# EAGLE design GabozePocaioRound2 (EAGLE 9.4.0)
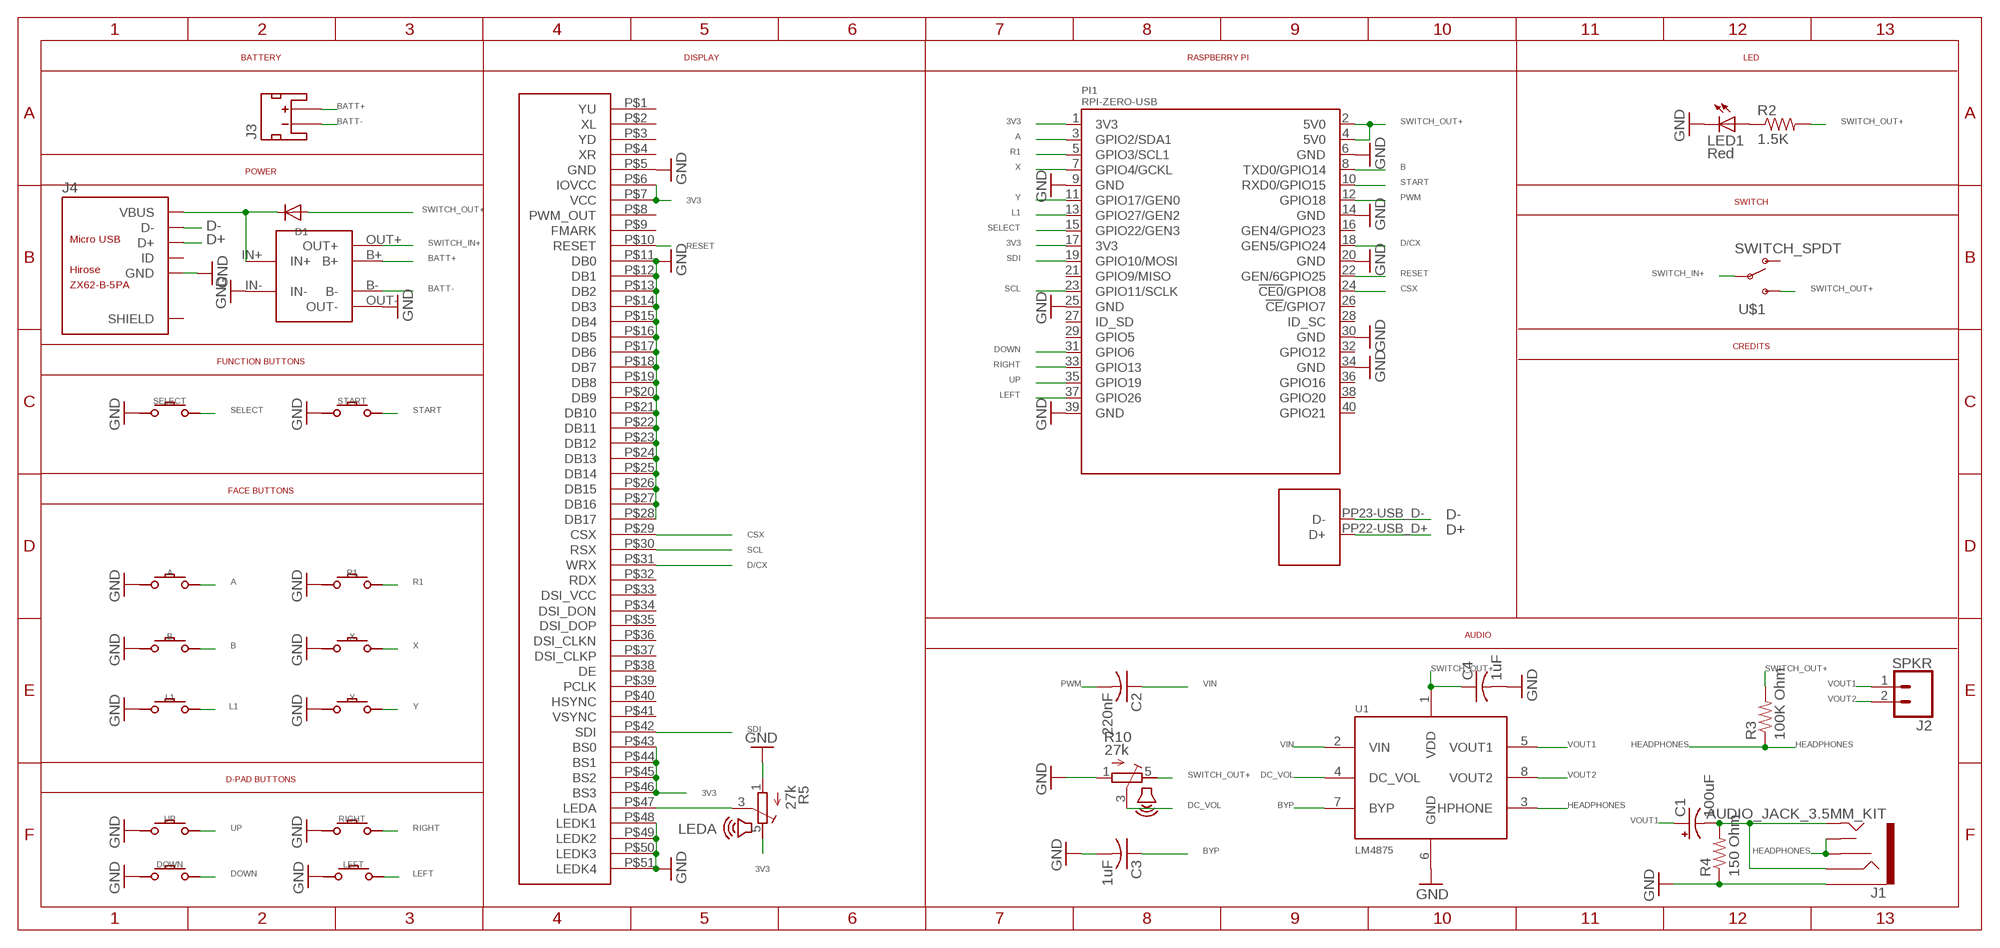
[diagram p0: schematic, sheet 1]

## Parts
A  CONDUCTIVE_BUTTONCONDUCTIVE_BUTTON_THICK  [CONDUCTIVE_BUTTON_THICK]
B  CONDUCTIVE_BUTTONCONDUCTIVE_BUTTON_THICK  [CONDUCTIVE_BUTTON_THICK]
C1  100uF  10UF-POLAR-EIA3216-16V-10%(TANT)  [EIA3216]
C2  220nF  C-USC0805  [C0805]
C3  1uF  C-USC0805  [C0805]
C4  1uF  C-USC0805  [C0805]
D1  DIODE_SOD-123FL  [SOD-123FL]
DOWN  CONDUCTIVE_BUTTONCONDUCTIVE_BUTTON_DIRECTIONAL_THICK  [CONDUCTIVE_BUTTON_DIRECTIONAL_THICK]
J1  AUDIO_JACK_3.5MM_KIT  [AUDIO-JACK-KIT]
J2  SPKR  CONN_02  [1X02]
J3  Batt Conn  JST_2MM_MALE  [JST-2-SMD]
J4  ZX62-B-5PA  MICRO-USB-SMD(ZX62-B-5PA)  [MICRO-USB5+6P-SMD-0.65-AB]
L1  CONDUCTIVE_BUTTON_DRILLCONDUCTIVE_BUTTON_DRILL_THICK  [CONDUCTIVE_BUTTON_THICK_DRILL]
LED1  Red  LED3MM  [LED3MM]
LEFT  CONDUCTIVE_BUTTONCONDUCTIVE_BUTTON_DIRECTIONAL_THICK  [CONDUCTIVE_BUTTON_DIRECTIONAL_THICK]
PI1  RPI-ZERO-USB  [RPI-ZERO-TH-USB-POGO]
POWER1  TP4056  [TP4056]
R1  CONDUCTIVE_BUTTON_DRILLCONDUCTIVE_BUTTON_DRILL_THICK  [CONDUCTIVE_BUTTON_THICK_DRILL]
R2  1.5K  R-US_R0805  [R0805]
R3  100K Ohm  R-US_R0805  [R0805]
R4  150 Ohm  R-US_R0805  [R0805]
R5  27k  VOLUME  [VOLUME]
R10  27k  VOLUME  [VOLUME]
RIGHT  CONDUCTIVE_BUTTONCONDUCTIVE_BUTTON_DIRECTIONAL_THICK  [CONDUCTIVE_BUTTON_DIRECTIONAL_THICK]
SELECT  CONDUCTIVE_BUTTON_STARTSELECTCONDUCTIVE_BUTTON_THICK_STARTSELECT  [CONDUCTIVE_BUTTON_THICK_STARTSELECT]
START  CONDUCTIVE_BUTTON_STARTSELECTCONDUCTIVE_BUTTON_THICK_STARTSELECT  [CONDUCTIVE_BUTTON_THICK_STARTSELECT]
U1  LM4875  [SOIC8]
U$1  SWITCH_SPDT  [KPS-1290]
U$2  TFT-DISPLAY-2.6-51PIN  [TFT-DISPLAY-2.6-51PIN]
UP  CONDUCTIVE_BUTTONCONDUCTIVE_BUTTON_DIRECTIONAL_THICK  [CONDUCTIVE_BUTTON_DIRECTIONAL_THICK]
X  CONDUCTIVE_BUTTON_DRILLCONDUCTIVE_BUTTON_DRILL_THICK  [CONDUCTIVE_BUTTON_THICK_DRILL]
Y  CONDUCTIVE_BUTTON_DRILLCONDUCTIVE_BUTTON_DRILL_THICK  [CONDUCTIVE_BUTTON_THICK_DRILL]

## Nets
3V3: PI1.1(3V3) PI1.17(3V3) R5.5(E) U$2.P$6(IOVCC) U$2.P$7(VCC) U$2.P$43(BS0) U$2.P$44(BS1) U$2.P$45(BS2) U$2.P$46(BS3)
A: A.P$ACTIVE PI1.3(GPIO2/SDA1)
B: B.P$ACTIVE PI1.8(TXD0/GPIO14)
BATT+: J3.2(+) POWER1.B+
BATT-: J3.1(-) POWER1.B-
BYP: C3.1 U1.7(BYP)
CSX: PI1.24(!CE0!/GPIO8) U$2.P$29(CSX)
D+: J4.3(D+) PI1.PP22-USB_D+(D+)
D-: J4.2(D-) PI1.PP23-USB_D-(D-)
D/CX: PI1.18(GEN5/GPIO24) U$2.P$31(WRX)
DC_VOL: R10.3(S) U1.4(DC_VOL)
DOWN: DOWN.P$ACTIVE PI1.31(GPIO6)
GND: A.P$GND B.P$GND C3.2 C4.2 DOWN.P$GND J1.SLEEVE J4.5(GND) L1.P$GND LED1.K(C) LEFT.P$GND PI1.6(GND) PI1.9(GND) PI1.14(GND) PI1.20(GND) PI1.25(GND) PI1.30(GND) PI1.34(GND) PI1.39(GND) POWER1.IN- POWER1.OUT- R1.P$GND R4.1 R5.1(A) R10.1(A) RIGHT.P$GND SELECT.P$GND SELECT.P$GND1(P$GND) SELECT.P$GND2(P$GND) SELECT.P$GND3(P$GND) START.P$GND START.P$GND1(P$GND) START.P$GND2(P$GND) START.P$GND3(P$GND) U1.6(GND) U$2.P$5(GND) U$2.P$11(DB0) U$2.P$12(DB1) U$2.P$13(DB2) U$2.P$14(DB3) U$2.P$15(DB4) U$2.P$16(DB5) U$2.P$17(DB6) U$2.P$18(DB7) U$2.P$19(DB8) U$2.P$20(DB9) U$2.P$21(DB10) U$2.P$22(DB11) U$2.P$23(DB12) U$2.P$24(DB13) U$2.P$25(DB14) U$2.P$26(DB15) U$2.P$27(DB16) U$2.P$28(DB17) U$2.P$48(LEDK1) U$2.P$49(LEDK2) U$2.P$50(LEDK3) U$2.P$51(LEDK4) UP.P$GND X.P$GND Y.P$GND
HEADPHONES: J1.RSH J1.TSH R3.1 U1.3(HPHONE)
L1: L1.P$ACTIVE PI1.13(GPIO27/GEN2)
LED: LED1.A R2.1
LEDA: R5.3(S) U$2.P$47(LEDA)
LEFT: LEFT.P$ACTIVE PI1.37(GPIO26)
PWM: C2.2 PI1.12(GPIO18)
R1: PI1.5(GPIO3/SCL1) R1.P$ACTIVE
RESET: PI1.22(GEN/6GPIO25) U$2.P$10(RESET)
RIGHT: PI1.33(GPIO13) RIGHT.P$ACTIVE
SCL: PI1.23(GPIO11/SCLK) U$2.P$30(RSX)
SDI: PI1.19(GPIO10/MOSI) U$2.P$42(SDI)
SELECT: PI1.15(GPIO22/GEN3) SELECT.P$ACTIVE SELECT.P$ACTIVE1(P$ACTIVE) SELECT.P$ACTIVE2(P$ACTIVE) SELECT.P$ACTIVE3(P$ACTIVE)
START: PI1.10(RXD0/GPIO15) START.P$ACTIVE START.P$ACTIVE1(P$ACTIVE) START.P$ACTIVE2(P$ACTIVE) START.P$ACTIVE3(P$ACTIVE)
SWITCH_IN+: POWER1.OUT+ U$1.P
SWITCH_OUT+: C4.1 D1.A PI1.2(5V0) PI1.4(5V0) R2.2 R3.2 R10.5(E) U1.1(VDD) U$1.S
UP: PI1.35(GPIO19) UP.P$ACTIVE
VIN: C2.1 U1.2(VIN)
VIN1: C1.- J1.RING J1.TIP R4.2
VOUT1: C1.+ J2.1 U1.5(VOUT1)
VOUT2: J2.2 U1.8(VOUT2)
VUSB: D1.C J4.1(VBUS) POWER1.IN+
X: PI1.7(GPIO4/GCKL) X.P$ACTIVE
Y: PI1.11(GPIO17/GEN0) Y.P$ACTIVE
Unconnected: J3.NC1(PAD1) J3.NC2(PAD2) J4.4(ID) J4.P1(SHIELD) J4.P2(SHIELD) J4.P3(SHIELD) J4.P4(SHIELD) J4.P5(SHIELD) J4.P6(SHIELD) PI1.16(GEN4/GPIO23) PI1.21(GPIO9/MISO) PI1.26(!CE!/GPIO7) PI1.27(ID_SD) PI1.28(ID_SC) PI1.29(GPIO5) PI1.32(GPIO12) PI1.36(GPIO16) PI1.38(GPIO20) PI1.40(GPIO21) U$1.O U$2.P$1(YU) U$2.P$2(XL) U$2.P$3(YD) U$2.P$4(XR) U$2.P$8(PWM_OUT) U$2.P$9(FMARK) U$2.P$32(RDX) U$2.P$33(DSI_VCC) U$2.P$34(DSI_DON) U$2.P$35(DSI_DOP) U$2.P$36(DSI_CLKN) U$2.P$37(DSI_CLKP) U$2.P$38(DE) U$2.P$39(PCLK) U$2.P$40(HSYNC) U$2.P$41(VSYNC)

## Notes on the sheet
- BATTERY | DISPLAY | RASPBERRY PI | LED
- POWER
- SWITCH
- CREDITS
- FUNCTION BUTTONS
- FACE BUTTONS
- AUDIO
- D-PAD BUTTONS

## Library data of the parts
A B DOWN LEFT RIGHT UP = 32teeth - Conductive Buttons:CONDUCTIVE_BUTTON
C1 = SparkFun-Capacitors:10UF-POLAR: 10.0µF polarized capacitors A capacitor is a passive two-terminal electrical component used to store electrical energy temporarily in an electric field.; PROD_ID: CAP-00811; VALUE: 10uF
C2-C4 = adafruit:C-US: CAPACITOR, American symbol
D1 = adafruit:DIODE: Diode SMADIODE - SMA Surface Mount Package 20V 1A Schottky Diode Digikey: 641-1014-6-ND DO-1N4148 - Through Hole Small Current Diode SOD-123 20V 1 A (.5mV Vf) Schottky Diode - Digikey: MBRX120TPMSCT-ND SOD-323 10V 570mA (.38mV Vf, 3ns) Schottky Diode - Digikey: ZLLS410CT-ND SOD-523 30V 30mA Schottky Diode (RB751S-40TE61) - Digikey: RB751S-40TE61CT-ND SOT23-R/W - SOT23 Package (R = Solder Paste/Reflow Ovens, W = Hand-Soldering) BAT54Film 40V 300mA - Digikey: 497-7162-1-ND
J1 = SparkFun-Connectors:AUDIO_JACK_3.5MM: Audio Jack 3.5mm variants of PTH and SMT stereo audio jack with bypass switches. SparkFun Products: SparkFun SparkPunk Sound Kit <[https://www.sparkfun.com/products/11177]> - PTH MP3 Trigger <https://www.sparkfun.com/products/13720> -3.5mm SMD SparkFun PicoBoard <https://www.sparkfun.com/products/11888>- 2.5mm SMD; PROD_ID: CONN-08774; SF_ID: PRT-08032
J2 = SparkFun-Connectors:CONN_02: Multi connection point. Often used as Generic Header-pin footprint for 0.1 inch spaced/style header connections On any of the 0.1 inch spaced packages, you can populate with these: Break Away Headers - Straight <https://www.sparkfun.com/products/116> (PRT-00116) Break Away Male Headers - Right Angle <https://www.sparkfun.com/products/553> (PRT-00553) Female Headers <https://www.sparkfun.com/products/115> (PRT-00115) Break Away Headers - Machine Pin <https://www.sparkfun.com/products/117> (PRT-00117) Break Away Female Headers - Swiss Machine Pin <https://www.sparkfun.com/products/743> (PRT-00743) For SCREWTERMINALS and SPRING TERMINALS visit here: Screw Terimnals on SparkFun.com <https://www.sparkfun.com/search/results?term=Screw+Terminals> (5mm/3.5mm/2.54mm spacing) This device is also useful as a general connection point to wire up your design to another part of your project. Our various solder wires solder well into these plated through hole pads. Hook-Up Wire - Assortment (Stranded, 22 AWG) <https://www.sparkfun.com/products/11375> (PRT-11375) Hook-Up Wire - Assortment (Solid Core, 22 AWG) <https://www.sparkfun.com/products/11367> (PRT-11367) View the entire wire category on our website here <https://www.sparkfun.com/categories/141> Special notes: Molex polarized connector foot print use with: PRT-08233 with associated crimp pins and housings. 2.54_SCREWTERM for use with PRT-10571. 3.5mm Screw Terminal footprints for PRT-08084 5mm Screw Terminal footprints for use with PRT-08432
J3 = SparkFun-Connectors:JST_2MM_MALE: Mates to single-cell LiPo batteries. CONN-11443 Now with smashable polarity marks!; BTM_NEG: -; BTM_POS: +; PROD_ID: CONN-11443; TOP_NEG: -; TOP_POS: +
J4 = Seeed-Connector:MICRO-USB-SMD(ZX62-B-5PA): 320010005; MPN: ZX62-B-5PA
L1 R1 X Y = 32teeth - Conductive Buttons:CONDUCTIVE_BUTTON_DRILL
LED1 = adafruit:LED: LED OSRAM: - CHIPLED LG R971, LG N971, LY N971, LG Q971, LY Q971, LO R971, LY R971 LH N974, LH R974 LS Q976, LO Q976, LY Q976 LO Q996 - Hyper CHIPLED LW Q18S LB Q993, LB Q99A, LB R99A - SideLED LS A670, LO A670, LY A670, LG A670, LP A670 LB A673, LV A673, LT A673, LW A673 LH A674 LY A675 LS A676, LA A676, LO A676, LY A676, LW A676 LS A679, LY A679, LG A679 - Hyper Micro SIDELED® LS Y876, LA Y876, LO Y876, LY Y876 LT Y87S - SmartLED LW L88C, LW L88S LB L89C, LB L89S, LG L890 LS L89K, LO L89K, LY L89K LS L896, LA L896, LO L896, LY L896 - TOPLED LS T670, LO T670, LY T670, LG T670, LP T670 LSG T670, LSP T670, LSY T670, LOP T670, LYG T670 LG T671, LOG T671, LSG T671 LB T673, LV T673, LT T673, LW T673 LH T674 LS T676, LA T676, LO T676, LY T676, LB T676, LH T676, LSB T676, LW T676 LB T67C, LV T67C, LT T67C, LS T67K, LO T67K, LY T67K, LW E67C LS E67B, LA E67B, LO E67B, LY E67B, LB E67C, LV E67C, LT E67C LW T67C LS T679, LY T679, LG T679 LS T770, LO T770, LY T770, LG T770, LP T770 LB T773, LV T773, LT T773, LW T773 LH T774 LS E675, LA E675, LY E675, LS T675 LS T776, LA T776, LO T776, LY T776, LB T776 LHGB T686 LT T68C, LB T68C - Hyper Mini TOPLED® LB M676 - Mini TOPLED Santana® LG M470 LS M47K, LO M47K, LY M47K Source: http://www.osram.convergy.de/
PI1 = 32teeth - Gaboze-Pi:RPI-ZERO-USB
POWER1 = 32teeth - TP4056 Module:TP4056
R2-R4 = adafruit:R-US_: RESISTOR, American symbol
R5 R10 = GBA:VOLUME
SELECT START = 32teeth - Conductive Buttons:CONDUCTIVE_BUTTON_STARTSELECT
U1 = texas:LM4875
U$1 = SparkFun-Retired:SWITCH_SPDT: SWCH-10651 Side-actuated SPDT slide switch, as used on the Arduino Pro; PROD_ID: SWCH-10651
U$2 = 32teeth - 2.6" TFT 51P:TFT-DISPLAY-2.6-51PIN: ILI9342 51P 2.6" TFT LCD

## Board
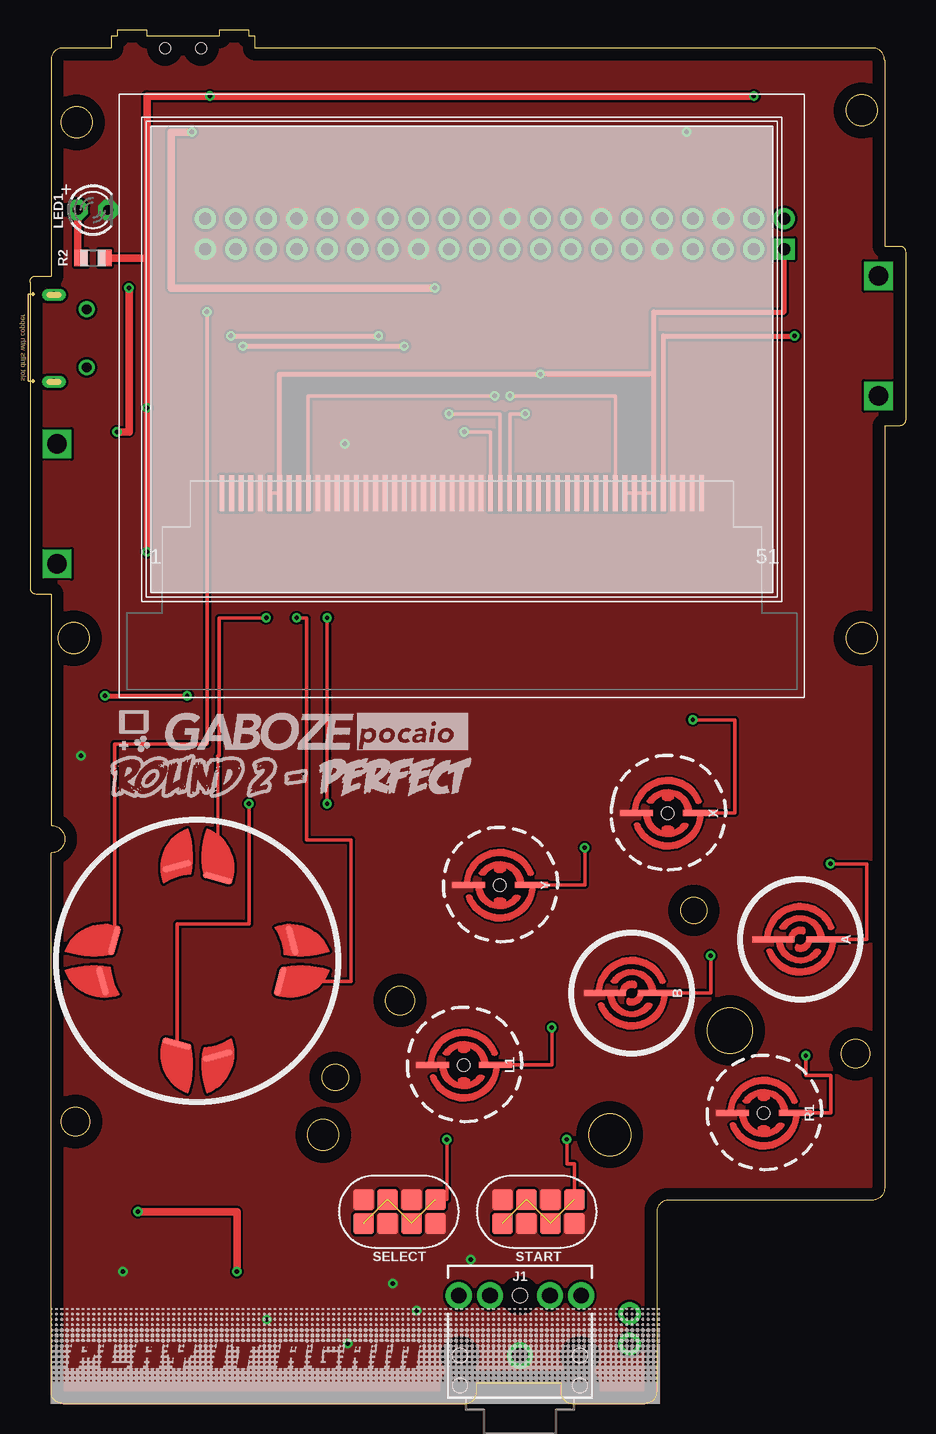
[diagram p1: board, top side]
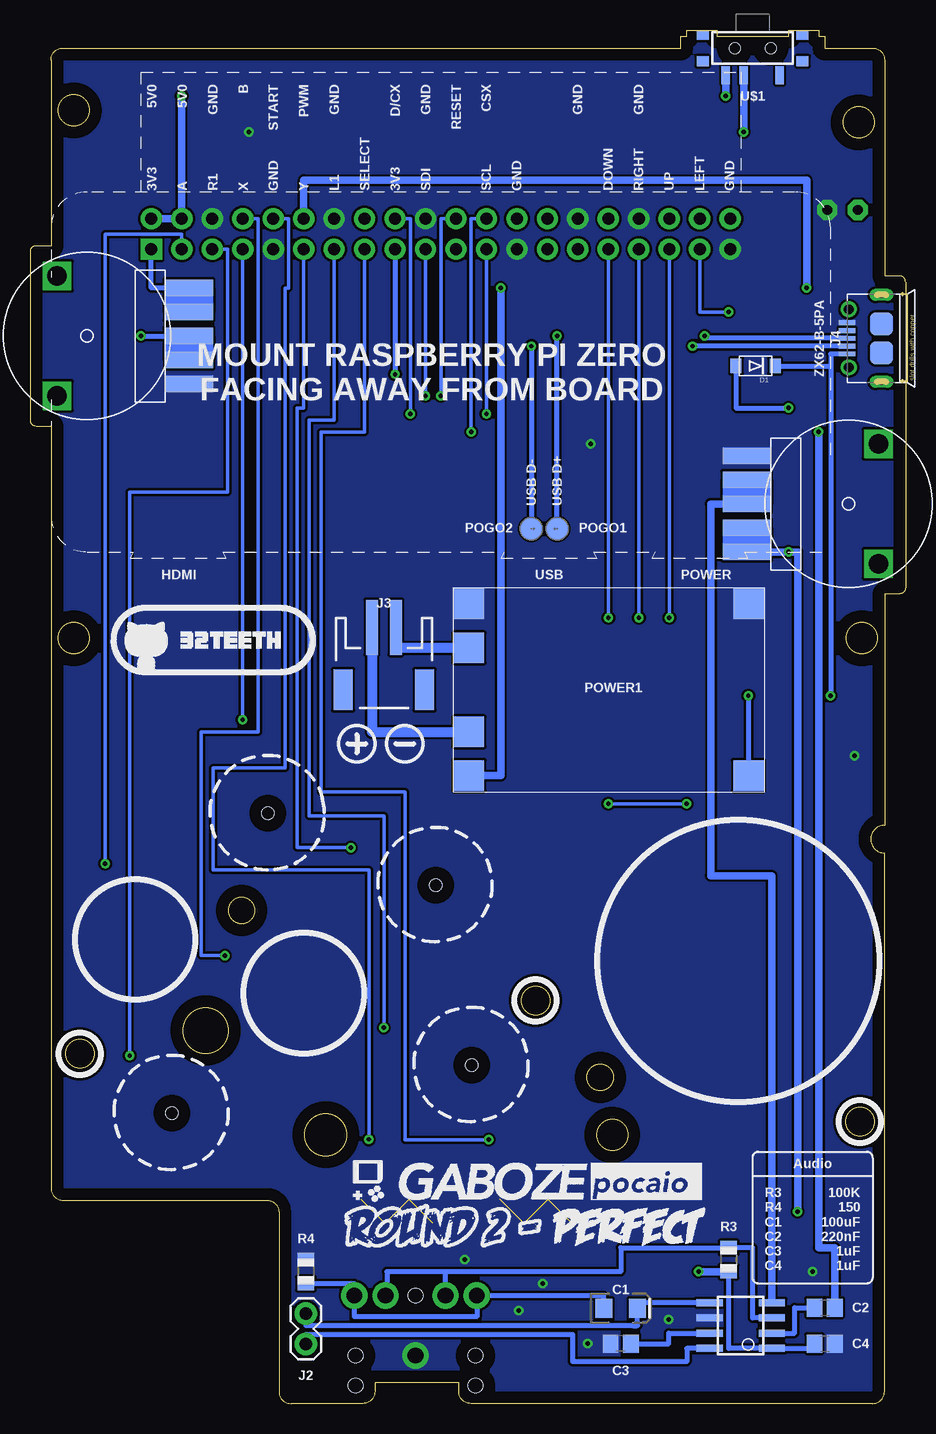
[diagram p2: board, bottom side, seen from below]

Size 73 x 114.5 mm. Coordinates in mm from the lower left corner, seen from the top.
Outline: 71.25,112 71.25,96.5 72.5,96.5 arc-90 73,96 73,82 arc-90 72.5,81.5 71.25,81.5 71.25,17.95 arc-90 70.25,16.95 53.25,16.95 arc90 52.25,15.95 52.25,1 arc-90 51.25,0 45.25,0 arc-90 44.25,1 44.25,1.75 37.25,1.75 37.25,1 arc-90 36.25,0 2.75,0 arc-90 1.75,1 1.75,45.9 arc180 1.75,48.2 1.75,67.5 0.5,67.5 arc-90 0,68 0,93.5 arc-90 0.5,94 1.75,94 1.75,112 arc-90 2.75,113 6.75,113 6.75,114 7.25,114 7.25,114.5 9.75,114.5 9.75,114 15.75,114 15.75,114.5 18.25,114.5 18.25,114 18.75,114 18.75,113 70.25,113 arc-90 71.25,112
Outline: circle at 3.8,23.5 radius 1.2
Outline: circle at 68.85,29.15 radius 1.2
Outline: circle at 58.35,31.1 radius 1.9
Outline: circle at 48.35,22.4 radius 1.75
Outline: circle at 30.85,33.6 radius 1.2
Outline: circle at 25.45,27.2 radius 1.1
Outline: circle at 24.45,22.4 radius 1.3
Outline: circle at 55.35,41.1 radius 1.1
Outline: circle at 69.35,107.8 radius 1.3
Outline: circle at 3.9,106.8 radius 1.3
Outline: circle at 69.35,63.8 radius 1.3
Outline: circle at 3.65,63.8 radius 1.3
Copper layers (1*16): Top 0.035mm / dielectric 1.5mm / Bottom 0.035mm
Design rules "default *": minimum track width 10mil, minimum drill 24mil, track to track 8mil, track to pad 8mil, pad to pad 8mil, via to via 8mil, smd to smd 8mil, copper to edge 40mil, drill to drill 8mil, minimum pad ring 10mil, minimum via ring 8mil, stop-mask expansion 5mil, vias tented up to drill 10mil, thermal gap 10mil

### Footprints (pad centres in the part's own frame; a part is rotated, then mirrored left to right if it is on the bottom)
CONDUCTIVE_BUTTON_THICK = smd 0.5 x 3.5: P$ACTIVE 0,-2.25; P$GND 0,2.25
EIA3216 = smd 1.4 x 1.6: + 1.4,0; - -1.4,0
C0805 = smd 1.3 x 1.5: 1 -0.85,0; 2 0.85,0
SOD-123FL = smd 0.91 x 1.22: A 1.637,0; C -1.637,0
CONDUCTIVE_BUTTON_DIRECTIONAL_THICK = smd 2.5 x 0.5 rotated 75: P$ACTIVE 1.1,1.7 | smd 2.5 x 0.5 rotated 285: P$GND 0.1,-1.7
AUDIO-JACK-KIT = drill 1.3 pad 2.184: RING 5,5.1; RSH 5,2.5; SLEEVE 0,0; TIP 5,-5.1; TSH 5,-2.5 | hole 1.2: 0,5; -2.5,5; -2.5,-5; 0,-5; 5,0
1X02 = drill 1.016 pad 1.88: 1 0,0; 2 2.54,0
JST-2-SMD = smd 1 x 4.6: 1 -1,-3.7; 2 1,-3.7 | smd 1.6 x 3.4: NC1 -3.4,1.5; NC2 3.4,1.5
MICRO-USB5+6P-SMD-0.65-AB = smd 0.4 x 1.35: 1 -1.3,2.875; 2 -0.65,2.875; 3 0,2.875; 4 0.65,2.875; 5 1.3,2.875 | smd 1.9 x 1.9: P1 -1.2,0; P2 1.2,0 | drill 0.508 pad 1.016 long: P3 -3.625,0; P4 3.625,0 | drill 0.8: P5 -2.425,2.73; P6 2.425,2.73
CONDUCTIVE_BUTTON_THICK_DRILL = smd 0.5 x 2.75: P$ACTIVE 0,-2.625; P$GND 0,2.625 | hole 1: 0,0
LED3MM = drill 0.813 pad 1.676 octagon: A -1.27,0; K 1.27,0
RPI-ZERO-TH-USB-POGO = drill 1 pad 1.778 square: 1 8.37,25.23 | drill 1 pad 1.778: 2 8.37,27.77; 3 10.91,25.23; 4 10.91,27.77; 5 13.45,25.23; 6 13.45,27.77; 7 15.99,25.23; 8 15.99,27.77; 9 18.53,25.23; 10 18.53,27.77; 11 21.07,25.23; 12 21.07,27.77; 13 23.61,25.23; 14 23.61,27.77; 15 26.15,25.23; 16 26.15,27.77; 17 28.69,25.23; 18 28.69,27.77; 19 31.23,25.23; 20 31.23,27.77; 21 33.77,25.23; 22 33.77,27.77; 23 36.31,25.23; 24 36.31,27.77; 25 38.85,25.23; 26 38.85,27.77; 27 41.39,25.23; 28 41.39,27.77; 29 43.93,25.23; 30 43.93,27.77; 31 46.47,25.23; 32 46.47,27.77; 33 49.01,25.23; 34 49.01,27.77; 35 51.55,25.23; 36 51.55,27.77; 37 54.09,25.23; 38 54.09,27.77; 39 56.63,25.23; 40 56.63,27.77 | smd 1.829 x 1.829: PP22-USB_D+ 42.2,1.9; PP23-USB_D- 40.05,1.9
TP4056 = smd 2.54 x 2.54: B+ 12,1.35; B- 5,1.35; IN+ 15.65,24.65; IN- 1.35,24.65; OUT+ 15.65,1.35; OUT- 1.35,1.35
R0805 = smd 1.1 x 1.4: 1 -1,0; 2 1,0
VOLUME = smd 1.4 x 4: 1 -4,-2; 2 -2,-2; 3 0,-2; 4 2,-2; 5 4,-2 | drill 1.6 square: P$6 -5,9; P$7 5,9
CONDUCTIVE_BUTTON_THICK_STARTSELECT = smd 1.75 x 1.75: P$ACTIVE 3,1; P$ACTIVE1 -1,1; P$ACTIVE2 -3,-1; P$ACTIVE3 1,-1; P$GND 1,1; P$GND1 -3,1; P$GND2 -1,-1; P$GND3 3,-1
SOIC8 = smd 0.6 x 2.2: 1 -1.905,-2.6; 2 -0.635,-2.6; 3 0.635,-2.6; 4 1.905,-2.6; 5 1.905,2.6; 6 0.635,2.6; 7 -0.635,2.6; 8 -1.905,2.6
KPS-1290 = smd 0.7 x 1.5: O -2.25,2.25; P 0.75,2.25; S 2.25,2.25 | smd 1 x 0.8: P$1 -4.15,1.1; P$2 -4.15,-1.1; P$3 4.15,-1.1; P$4 4.15,1.1 | hole 0.9: -1.5,0; 1.5,0
TFT-DISPLAY-2.6-51PIN = smd 0.4 x 3: P$1 -20,-8.12; P$2 -19.2,-8.12; P$3 -18.4,-8.12; P$4 -17.6,-8.12; P$5 -16.8,-8.12; P$6 -16,-8.12; P$7 -15.2,-8.12; P$8 -14.4,-8.12; P$9 -13.6,-8.12; P$10 -12.8,-8.12; P$11 -12,-8.12; P$12 -11.2,-8.12; P$13 -10.4,-8.12; P$14 -9.6,-8.12; P$15 -8.8,-8.12; P$16 -8,-8.12; P$17 -7.2,-8.12; P$18 -6.4,-8.12; P$19 -5.6,-8.12; P$20 -4.8,-8.12; P$21 -4,-8.12; P$22 -3.2,-8.12; P$23 -2.4,-8.12; P$24 -1.6,-8.12; P$25 -0.8,-8.12; P$26 0,-8.12; P$27 0.8,-8.12; P$28 1.6,-8.12; P$29 2.4,-8.12; P$30 3.2,-8.12; P$31 4,-8.12; P$32 4.8,-8.12; P$33 5.6,-8.12; P$34 6.4,-8.12; P$35 7.2,-8.12; P$36 8,-8.12; P$37 8.8,-8.12; P$38 9.6,-8.12; P$39 10.4,-8.12; P$40 11.2,-8.12; P$41 12,-8.12; P$42 12.8,-8.12; P$43 13.6,-8.12; P$44 14.4,-8.12; P$45 15.2,-8.12; P$46 16,-8.12; P$47 16.8,-8.12; P$48 17.6,-8.12; P$49 18.4,-8.12; P$50 19.2,-8.12; P$51 20,-8.12

### Placement (x,y rotation side)
A  64.22,38.7 90 top
B  50.17,34.21 90 top
C1  23.75,7.95 0 bottom
C2  6.75,8 0 bottom
C3  23.75,5 180 bottom
C4  6.75,5 0 bottom
D1  12.5,86.5 180 bottom
DOWN  13.95,28.9 90 top
J1  40.85,4 90 top
J2  50,7.5 270 bottom
J3  43.5,61 180 bottom
J4  2,88.8 90 bottom
L1  36.17,28.21 90 top
LED1  5.25,99.5 0 top
LEFT  5.95,36.9 0 top
PI1  71.25,71 0 bottom
POWER1  37.75,68 270 bottom
R1  61.17,24.21 90 top
R2  5.25,95.5 0 top
R3  14.75,12 270 bottom
R4  50,11 270 bottom
R5  61.75,89 90 bottom
R10  11.25,75 270 bottom
RIGHT  21.95,36.9 180 top
SELECT  30.8,16.01 0 top
START  42.41,16.01 0 top
U1  13.75,6.5 90 bottom
U$1  12.75,113 180 bottom
U$2  36,84 0 top
UP  13.95,44.9 270 top
X  53.17,49.21 90 top
Y  39.17,43.21 90 top

### Tracks (layer width: path | path; a pad name or v marks a point on that pad's centre or on a via)
3V3  (via drill 0.35)
  Top 0.305: U$2.P$7 U$2.P$6 | U$2.P$43 U$2.P$44 U$2.P$45 U$2.P$46
  Top 0.406: 52,85.8 v42.56,85.8 20.8,85.8 U$2.P$7 | U$2.P$46 52,85.8 | 52,85.8 52,91 62.88,91 PI1.1
  Bottom 0.406: PI1.17 v42.56,85.8 | R5.5 62.88,93 PI1.1
A  (via drill 0.35)
  Top 0.305: v66.75,45 69.75,45 69.75,38.7 A.P$ACTIVE
  Bottom 0.305: v66.75,45 66.75,97.5 | PI1.3 60.34,97.5 66.75,97.5 | 66.75,97.5
B  (via drill 0.35)
  Top 0.305: v56.75,37.34 56.75,34.21 B.P$ACTIVE
  Bottom 0.305: PI1.8 53.99,98.77 53.99,56 58.75,56 58.75,37.34 v56.75,37.34
BATT+
  Bottom 0.813: J3.2 44.5,56 POWER1.B+
BATT-
  Bottom 0.813: POWER1.B- 42.5,63 J3.1
BYP
  Bottom 0.406: C3.1 19.75,5 19.75,5.87 U1.7
CSX  (via drill 0.35)
  Top 0.305: U$2.P$29 38.4,81 v36.21,81
  Bottom 0.305: PI1.24 36.21,98.77 v36.21,81
D+  (via drill 0.35)
  Top 0.406: v16.75,89 v29.05,89
  Bottom 0.406: J4.3 16.75,88.8 v16.75,89 | PI1.PP22-USB_D+ v29.05,89
D-  (via drill 0.35)
  Top 0.406: v17.75,88.15 v31.2,88.15
  Bottom 0.406: J4.2 v17.75,88.15 | v31.2,88.15 PI1.PP23-USB_D-
D/CX  (via drill 0.35)
  Top 0.305: U$2.P$31 40,82.5 v41.29,82.5
  Bottom 0.305: PI1.18 41.29,98.77 v41.29,82.5
DC_VOL
  Bottom 0.61: U1.4 11.15,44 16.25,44 16.25,75 R10.3
DOWN  (via drill 0.35)
  Top 0.305: v24.78,65.5 v24.78,50 | v18.25,50 18.25,40 12.25,40 DOWN.P$ACTIVE
  Bottom 0.305: v18.25,50 v24.78,50 | PI1.31 v24.78,65.5
GND  (via drill 0.35)
  other vias: 36.75,12 30.25,10 32.25,7.75 7.75,11 54.75,106 26.5,5 19.75,7 4.25,54 26.25,80
  pour Top (no thermals): 1.75,0 37.25,0 37.25,1.75 44.25,1.75 44.25,0 52.25,0 52.25,16.95 71.25,16.95 71.25,81.5 73,81.5 73,96.5 71.25,96.5 71.25,113 18.75,113 18.75,114 18.25,114 18.25,114.5 15.75,114.5 15.75,114 9.75,114 9.75,114.5 7.25,114.5 7.25,114 6.75,114 6.75,113 1.75,113 1.75,94 0,94 0,67.5 1.75,67.5
  pour Bottom (no thermals): 1.75,0 37.25,0 37.25,1.75 44.25,1.75 44.25,0 52.25,0 52.25,16.95 71.25,16.95 71.25,81.5 73,81.5 73,96.5 71.25,96.5 71.25,113 18.75,113 18.75,114 18.25,114 18.25,114.5 15.75,114.5 15.75,114 9.75,114 9.75,114.5 7.25,114.5 7.25,114 6.75,114 6.75,113 1.75,113 1.75,94 0,94 0,67.5 1.75,67.5
HEADPHONES
  Bottom 0.406: 38.35,11 23.75,11 23.75,13 R3.1 12.75,13 12.75,7.13 U1.3 | 38.35,11 43.25,11 43.25,9 J1.TSH | J1.RSH 38.35,11
L1  (via drill 0.35)
  Top 0.305: v43.5,31.34 43.5,28.21 L1.P$ACTIVE
  Bottom 0.305: PI1.13 47.64,82 49.75,82 49.75,49 43.5,49 v43.5,31.34
LED
  Top 0.61: LED1.A 3.98,95.5 R2.1
LEDA  (via drill 0.35)
  Top 0.406: U$2.P$47 52.8,89 v63.75,89
  Bottom 0.406: v63.75,89 R5.3
LEFT  (via drill 0.35)
  Top 0.305: v14.75,91 14.75,55 7.08,55 LEFT.P$ACTIVE
  Bottom 0.305: PI1.37 17.16,91 v14.75,91
PWM  (via drill 0.35)
  Top 0.61: v8.25,93 8.25,81 v7.25,81
  Bottom 0.61: PI1.12 50.18,102 8.25,102 v8.25,93 | v7.25,81 7.25,13 5.9,13 C2.2
R1  (via drill 0.35)
  Top 0.305: v64.69,29 64.69,27.34 66.75,27.34 66.75,24.21 R1.P$ACTIVE
  Bottom 0.305: v64.69,29 64.69,76 56.53,76 56.53,96.23 PI1.5
RESET  (via drill 0.35)
  Top 0.305: U$2.P$10 23.2,84 v38.75,84
  Bottom 0.305: PI1.22 38.75,98.77 v38.75,84
RIGHT  (via drill 0.35)
  Top 0.305: v22.24,65.5 23.07,65.5 23.07,47 26.75,47 26.75,35.2 RIGHT.P$ACTIVE
  Bottom 0.305: v22.24,65.5 PI1.33
SCL  (via drill 0.35)
  Top 0.305: U$2.P$30 39.2,82.5 v34.94,82.5
  Bottom 0.305: v34.94,82.5 PI1.23
SDI  (via drill 0.35)
  Top 0.305: U$2.P$42 48.8,84 v40.02,84
  Bottom 0.305: v40.02,84 PI1.19
SELECT  (via drill 0.35)  (3 unrouted)
  Top 0.305: v34.75,22 34.75,17.01 SELECT.P$ACTIVE
  Bottom 0.305: v34.75,22 41.75,22 41.75,51 48.75,51 48.75,81 45.09,81 PI1.15
START  (via drill 0.35)  (3 unrouted)
  Top 0.305: v44.75,22.01 44.75,20 45.41,20 START.P$ACTIVE
  Bottom 0.305: PI1.10 51.45,98.77 51.45,93 51.75,93 51.75,53 57.75,53 57.75,44.5 44.75,44.5 v44.75,22.01
SWITCH_IN+  (via drill 0.35)
  Top 0.61: v13.5,106 11.75,106 11.75,93 v33.75,93
  Bottom 0.61: POWER1.OUT+ 33.75,52.35 v33.75,93 | U$1.P v13.5,106
SWITCH_OUT+  (via drill 0.35)
  Top 0.61: v60.34,109 v15,109 9.75,109 9.75,95.5 | v9.75,71 v9.75,83 9.75,95.5 | v17.25,11 17.25,16 v9,16 | R2.2 9.75,95.5
  Bottom 0.254: 7.6,4.59 C4.1
  Bottom 0.406: R3.2 14.75,4.59 U1.1 7.6,4.59 | D1.A 14.14,83 v9.75,83
  Bottom 0.61: PI1.2 PI1.4 v60.34,109 | R3.2 v17.25,11 | U$1.S v15,109 | R10.5 v9.75,71 9,71 v9,16
UP  (via drill 0.35)
  Top 0.254: 15.65,54 UP.P$ACTIVE
  Top 0.305: v19.7,65.5 15.75,65.5 15.75,54 15.65,54
  Bottom 0.305: PI1.35 v19.7,65.5
VIN
  Bottom 0.406: U1.2 9.25,5.87 9.25,8 C2.1
VIN1
  Bottom 0.406: R4.2 45.95,10 J1.TIP 45.95,7.25 35.75,7.25 J1.RING 25.15,9 C1.-
VOUT1
  Bottom 0.254: 22.9,8.4 C1.+ | 22.35,6.5 22.75,6.5
  Bottom 0.406: J2.1 50,6.5 22.75,6.5 22.35,6.5 C1.+ 22.35,8.4 U1.5
VOUT2
  Bottom 0.406: U1.8 18.25,4.59 18.25,3.5 27.75,3.5 27.75,5.75 50,5.75 J2.2
VUSB  (via drill 0.35)
  Top 0.406: v6.25,59 v13.1,59
  Bottom 0.406: J4.1 5.75,87.5 6.25,87.5 6.25,86.5 | 6.25,86.5 v6.25,59 | v13.1,59 POWER1.IN+ | D1.C 6.25,86.5
X  (via drill 0.35)
  Top 0.305: v55.26,57 58.75,57 58.75,49.21 X.P$ACTIVE
  Bottom 0.305: PI1.7 v55.26,57
Y  (via drill 0.35)
  Top 0.305: v46.25,46.34 46.25,43.21 Y.P$ACTIVE
  Bottom 0.305: PI1.11 50.18,83 50.75,83 50.75,46.34 v46.25,46.34
(copper drawn outside any net)
  shapes: Bottom area x4

### Text on the board
bPlace: 5V0 / 5V0 / GND / B / START / PWM / GND / / D/CX / GND / RESET / CSX / / / GND / / GND | 3V3 / A / R1 / X / GND / Y / L1 / SELECT / 3V3 / SDI / / SCL / GND / / / DOWN / RIGHT / UP / LEFT / GND | Audio | 100K / 150 / 100uF / 220nF / 1uF / 1uF | R3 / R4 / C1 / C2 / C3 / C4 | R3 | R4 | C1 | C2 | C4 | C3
bNames: POGO1 | POGO2
200bmp: 32teeth | 32teeth | 32teeth | 32teeth